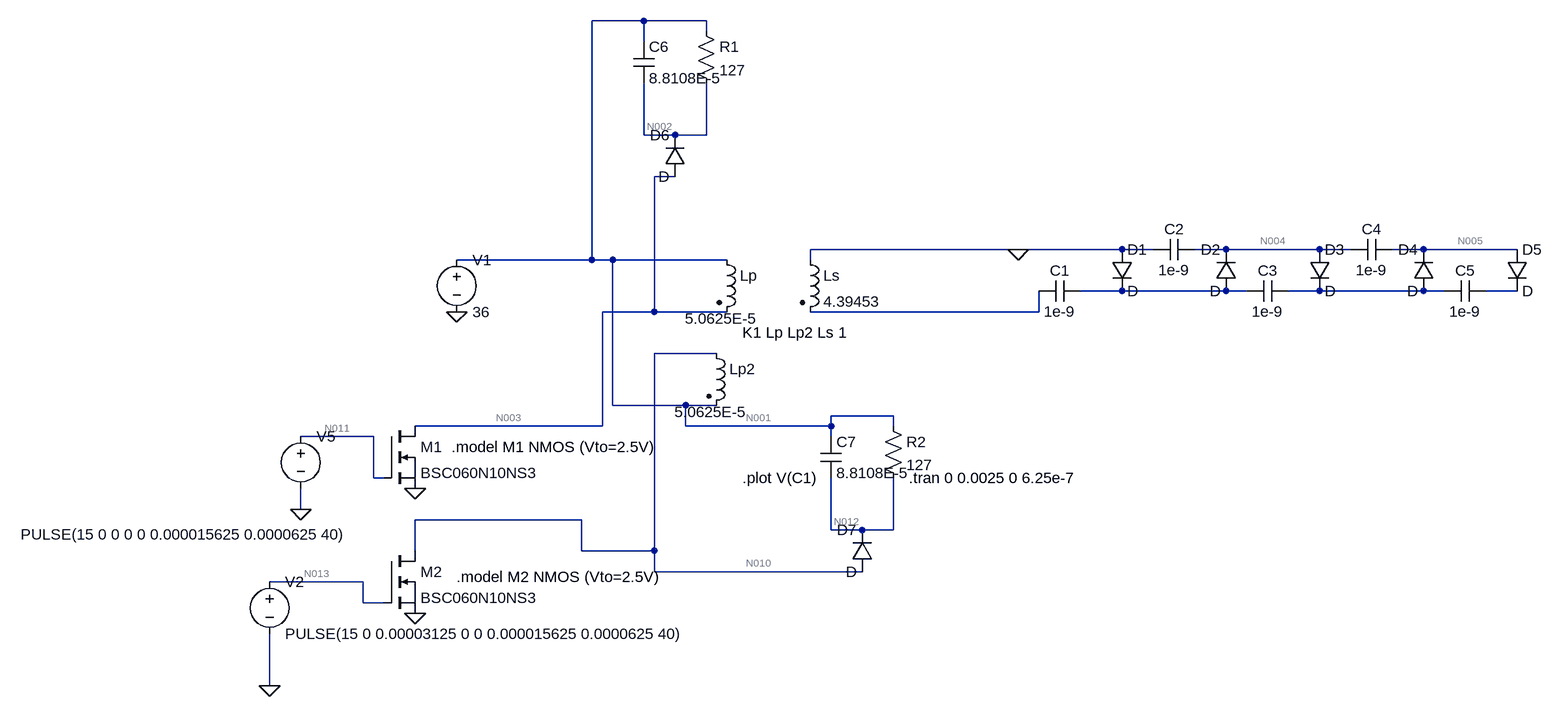
[diagram p0: schematic VillardCascadingModel2.asc]
VillardCascadingModel2.asc, the LTspice schematic file:
Version 4
SHEET 1 880 832
WIRE -816 -304 -896 -304
WIRE -720 -304 -816 -304
WIRE -720 -288 -720 -304
WIRE -816 -272 -816 -304
WIRE -816 -128 -816 -208
WIRE -768 -128 -816 -128
WIRE -720 -128 -720 -208
WIRE -720 -128 -768 -128
WIRE -768 -64 -800 -64
WIRE -240 48 -560 48
WIRE -80 48 -240 48
WIRE -32 48 -80 48
WIRE 80 48 32 48
WIRE 224 48 80 48
WIRE 272 48 224 48
WIRE 384 48 336 48
WIRE 528 48 384 48
WIRE -896 64 -896 -304
WIRE -896 64 -1104 64
WIRE -864 64 -896 64
WIRE -688 64 -864 64
WIRE -560 64 -560 48
WIRE -80 112 -144 112
WIRE 80 112 -80 112
WIRE 112 112 80 112
WIRE 224 112 176 112
WIRE 384 112 224 112
WIRE 416 112 384 112
WIRE 528 112 480 112
WIRE -800 144 -800 -64
WIRE -800 144 -880 144
WIRE -688 144 -800 144
WIRE -208 144 -208 112
WIRE -208 144 -560 144
WIRE -704 208 -800 208
WIRE -864 288 -864 64
WIRE -752 288 -864 288
WIRE -704 288 -752 288
WIRE -432 304 -528 304
WIRE -880 320 -880 144
WIRE -880 320 -1168 320
WIRE -752 320 -752 288
WIRE -528 320 -528 304
WIRE -528 320 -752 320
WIRE -432 320 -432 304
WIRE -1232 336 -1344 336
WIRE -528 336 -528 320
WIRE -1232 400 -1232 336
WIRE -1216 400 -1232 400
WIRE -1344 448 -1344 416
WIRE -912 464 -1168 464
WIRE -528 480 -528 400
WIRE -480 480 -528 480
WIRE -432 480 -432 400
WIRE -432 480 -480 480
WIRE -1168 512 -1168 464
WIRE -912 512 -912 464
WIRE -800 512 -800 208
WIRE -800 512 -912 512
WIRE -800 544 -800 512
WIRE -480 544 -800 544
WIRE -1248 560 -1392 560
WIRE -1248 592 -1248 560
WIRE -1216 592 -1248 592
WIRE -1392 720 -1392 640
FLAG -240 48 0
FLAG -1104 144 0
FLAG -1392 720 0
FLAG -1344 448 0
FLAG -1168 416 0
FLAG -1168 608 0
SYMBOL diode -96 48 R0
SYMATTR InstName D1
SYMBOL diode 96 112 R180
WINDOW 0 24 64 Left 2
WINDOW 3 24 0 Left 2
SYMATTR InstName D2
SYMBOL diode 208 48 R0
SYMATTR InstName D3
SYMBOL diode 400 112 R180
WINDOW 0 24 64 Left 2
WINDOW 3 24 0 Left 2
SYMATTR InstName D4
SYMBOL cap -144 96 R90
WINDOW 0 0 32 VBottom 2
WINDOW 3 32 32 VTop 2
SYMATTR InstName C1
SYMATTR Value 1e-9
SYMBOL cap 32 32 R90
WINDOW 0 0 32 VBottom 2
WINDOW 3 32 32 VTop 2
SYMATTR InstName C2
SYMATTR Value 1e-9
SYMBOL cap 176 96 R90
WINDOW 0 0 32 VBottom 2
WINDOW 3 32 32 VTop 2
SYMATTR InstName C3
SYMATTR Value 1e-9
SYMBOL cap 336 32 R90
WINDOW 0 0 32 VBottom 2
WINDOW 3 32 32 VTop 2
SYMATTR InstName C4
SYMATTR Value 1e-9
SYMBOL cap 480 96 R90
WINDOW 0 0 32 VBottom 2
WINDOW 3 32 32 VTop 2
SYMATTR InstName C5
SYMATTR Value 1e-9
SYMBOL diode 512 48 R0
SYMATTR InstName D5
SYMBOL ind2 -704 48 R0
WINDOW 3 -49 106 Left 2
SYMATTR Value 5.0625E-5
SYMATTR InstName Lp
SYMATTR Type ind
SYMBOL ind2 -576 48 R0
SYMATTR InstName Ls
SYMATTR Value 4.39453
SYMATTR Type ind
SYMBOL voltage -1104 48 R0
WINDOW 123 0 0 Left 0
WINDOW 39 0 0 Left 0
SYMATTR InstName V1
SYMATTR Value 36
SYMBOL ind2 -720 192 R0
WINDOW 3 -49 106 Left 2
SYMATTR Value 5.0625E-5
SYMATTR InstName Lp2
SYMATTR Type ind
SYMBOL cap -832 -272 R0
SYMATTR InstName C6
SYMATTR Value 8.8108E-5
SYMBOL res -736 -304 R0
SYMATTR InstName R1
SYMATTR Value 127
SYMBOL diode -752 -64 R180
WINDOW 0 24 64 Left 2
WINDOW 3 24 0 Left 2
SYMATTR InstName D6
SYMBOL cap -544 336 R0
SYMATTR InstName C7
SYMATTR Value 8.8108E-5
SYMBOL res -448 304 R0
SYMATTR InstName R2
SYMATTR Value 127
SYMBOL diode -464 544 R180
WINDOW 0 24 64 Left 2
WINDOW 3 24 0 Left 2
SYMATTR InstName D7
SYMBOL voltage -1344 320 R0
WINDOW 3 -431 167 Left 2
WINDOW 123 0 0 Left 0
WINDOW 39 0 0 Left 0
SYMATTR InstName V5
SYMATTR Value PULSE(15 0 0 0 0 0.000015625 0.0000625 40)
SYMBOL voltage -1392 544 R0
WINDOW 123 0 0 Left 0
WINDOW 39 0 0 Left 0
SYMATTR InstName V2
SYMATTR Value PULSE(15 0 0.00003125 0 0 0.000015625 0.0000625 40)
SYMBOL nmos -1216 320 R0
SYMATTR InstName M1
SYMATTR Value BSC060N10NS3
SYMBOL nmos -1216 512 R0
SYMATTR InstName M2
SYMATTR Value BSC060N10NS3
TEXT -408 400 Left 2 !.tran 0 0.0025 0 6.25e-7
TEXT -664 400 Left 2 !.plot V(C1)
TEXT -664 176 Left 2 !K1 Lp Lp2 Ls 1
TEXT -1112 352 Left 2 !.model M1 NMOS (Vto=2.5V)
TEXT -1104 552 Left 2 !.model M2 NMOS (Vto=2.5V)

The netlist it stands for:
* VillardCascadingModel2.asc
D1 0 N006 D
D2 N006 N004 D
D3 N004 N007 D
D4 N007 N005 D
C1 N006 N009 1e-9
C2 N004 0 1e-9
C3 N007 N006 1e-9
C4 N005 N004 1e-9
C5 N008 N007 1e-9
D5 N005 N008 D
Lp N001 N003 5.0625E-5
Ls 0 N009 4.39453
V1 N001 0 36
Lp2 N010 N001 5.0625E-5
C6 N001 N002 8.8108E-5
R1 N001 N002 127
D6 N003 N002 D
C7 N001 N012 8.8108E-5
R2 N001 N012 127
D7 N010 N012 D
V5 N011 0 PULSE(15 0 0 0 0 0.000015625 0.0000625 40)
V2 N013 0 PULSE(15 0 0.00003125 0 0 0.000015625 0.0000625 40)
M1 N003 N011 0 0 BSC060N10NS3
M2 N010 N013 0 0 BSC060N10NS3
.model D D
.lib standard.dio
.model NMOS NMOS
.model PMOS PMOS
.lib standard.mos
.tran 0 0.0025 0 6.25e-7
.plot V(C1)
K1 Lp Lp2 Ls 1
.model M1 NMOS (Vto=2.5V)
.model M2 NMOS (Vto=2.5V)
.backanno
.end

* Results of the author's LTspice run, read from the files saved beside the schematic
* Operating Point, zero values left out:
*   V(n001) = 36 V
*   V(n003) = 36 V
*   V(n010) = 36 V
*   V(n002) = 36 V
*   V(n012) = 36 V
*   V(n011) = 15 V
*   V(n013) = 15 V
*   Id(M1) = 6.744 kA
*   Is(M1) = -6.744 kA
*   Id(M2) = 6.744 kA
*   Is(M2) = -6.744 kA
*   I(Lp) = 6.744 kA
*   I(Lp2) = -6.744 kA
*   I(V1) = -13.49 kA
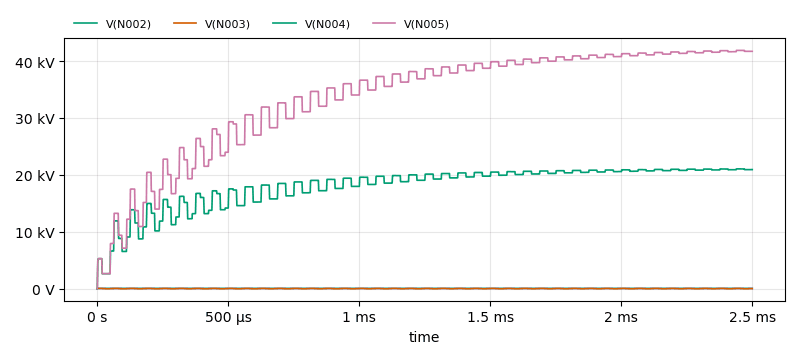
[diagram p1: Transient Analysis of VillardCascadingModel2.asc, plotted from the saved traces]
* Transient Analysis, 1 run:
*   V(N002): min 36 V, max 71.17 V, average 71.08 V, rms 71.09 V, last 71.02 V
*   V(N003): min -36.58 mV, max 71.98 V, average 35.98 V, rms 44.8 V, last 36 V
*   V(N004): min 0 V, max 21.06 kV, average 18.07 kV, rms 18.47 kV, last 20.94 kV
*   V(N005): min 0 V, max 41.88 kV, average 33.63 kV, rms 34.97 kV, last 41.71 kV